# Altium schematic sheet Power.SchDoc: Power
size A; Author: Craig Hesling; DrawnBy: Craig Hesling; Revision: 1.1
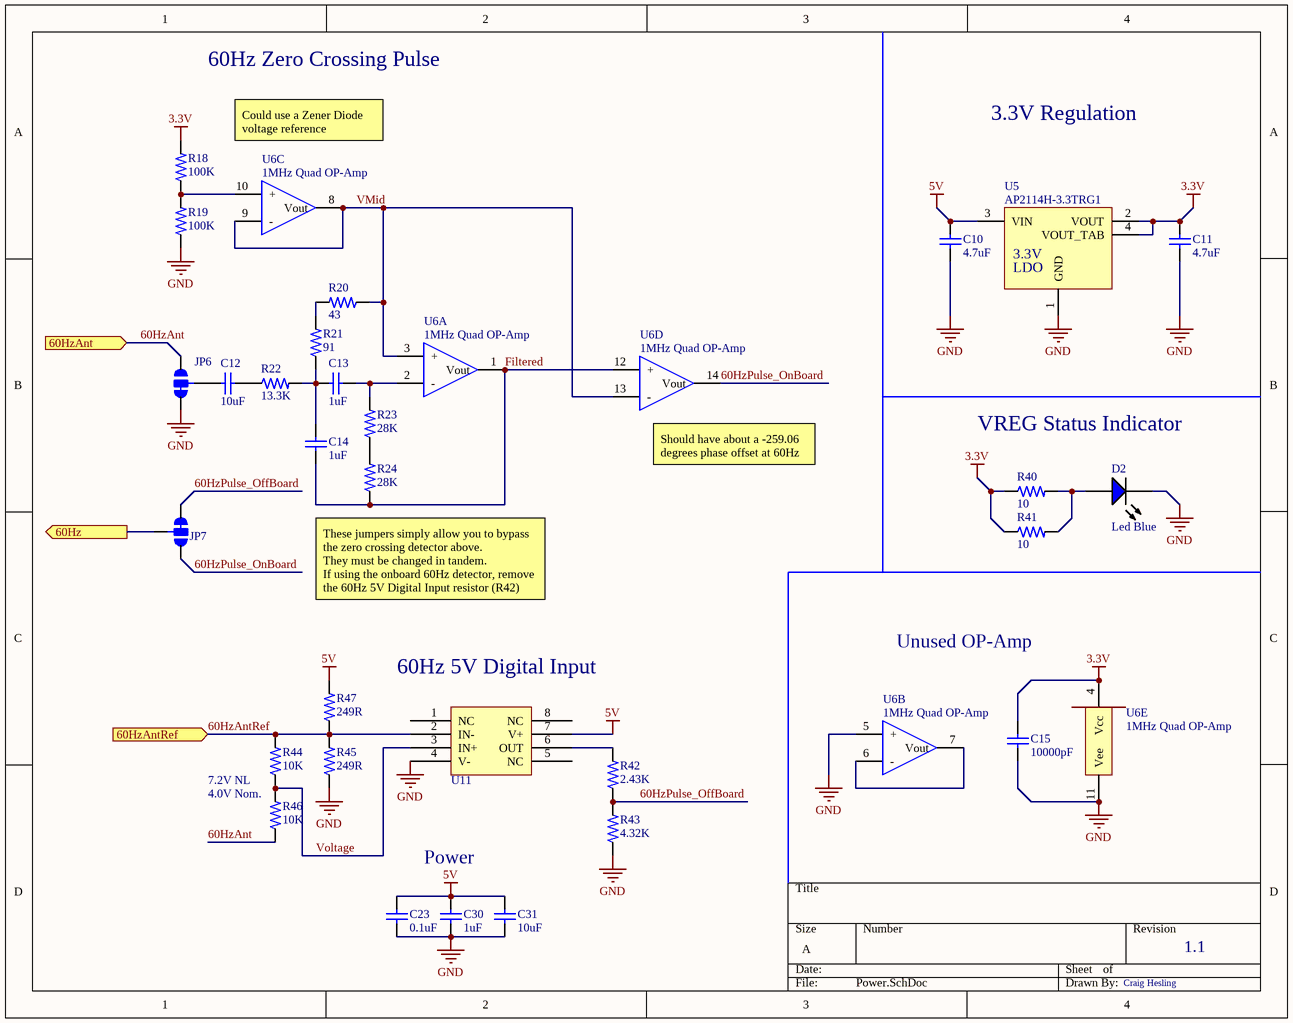
[diagram p0: Power.SchDoc]

## Parts
C10  4.7uF  [CAPC3216X18L - CAP1206 1.8MM TALL]
C11  4.7uF  [CAPC3216X18L - CAP1206 1.8MM TALL]
C12  10uF  [CAPC1608X09L - CAP0603]
C13  1uF  [CAPC1608X09L - CAP0603]
C14  1uF  [CAPC1608X09L - CAP0603]
C15  10000pF  [CAPC1608X09L - CAP0603]
C23  0.1uF  [CAPC1608X09L - CAP0603]
C30  1uF  [CAPC1608X09L - CAP0603]
C31  10uF  [CAPC1608X09L - CAP0603]
D2  Led Blue  [LED-0603-BLUE .7MM TALL]
JP6  JUMPER-PAD-3-2OF3_NC_BY_TRACE_SMALL  [PAD-JUMPER-3-2OF3_NC_BY_TRACE_YES_SILK_FULL_BOX]  (value not drawn)
JP7  JUMPER-PAD-3-2OF3_NC_BY_TRACE_SMALL  [PAD-JUMPER-3-2OF3_NC_BY_TRACE_YES_SILK_FULL_BOX]  (value not drawn)
R18  100K  [RESC1608X06L - RES0603]
R19  100K  [RESC1608X06L - RES0603]
R20  43  [RESC1608X06L - RES0603]
R21  91  [RESC1608X06L - RES0603]
R22  13.3K  [RESC1608X06L - RES0603]
R23  28K  [RESC1608X06L - RES0603]
R24  28K  [RESC1608X06L - RES0603]
R40  10  [RESC1608X06L - RES0603]
R41  10  [RESC1608X06L - RES0603]
R42  2.43K  [RESC1608X06L - RES0603]
R43  4.32K  [RESC1608X06L - RES0603]
R44  10K  [RESC1608X06L - RES0603]
R45  249R  [RESC1608X06L - RES0603]
R46  10K  [RESC1608X06L - RES0603]
R47  249R  [RESC1608X06L - RES0603]
U5  AP2114H-3.3TRG1  [SOT230P700X180-4L]
U6  1MHz Quad OP-Amp  [SOIC127P600X175-14L]  (parts A,B,C,D,E of 5)
U11  LT1818IS8#PBF  [SOIC127P600X175-8N]  (value not drawn)

## Ports
60Hz (out), 60HzAnt (in), 60HzAntRef (in)

## Nets
3.3V: C11.2 C15.2 R18.2 R40.1 R41.1 U5.2(VOUT) U5.4(VOUT_TAB) U6.4(Vcc)
5V: C10.2 C23.2 C30.2 C31.2 R47.2 U5.3(VIN) U11.7(V+)
GND: C10.1 C11.1 C15.1 C23.1 C30.1 C31.1 D2.K JP6.3 R19.1 R43.1 R45.1 U5.1(GND) U6.5(+) U6.11(Vee) U11.4(V-)
60Hz: JP7.2 ; port 60Hz
60HzAnt: JP6.1 R46.1 ; port 60HzAnt
60HzAntRef: R44.2 R45.2 R47.1 U11.2(IN-) ; port 60HzAntRef
60HzPulse_OffBoard: JP7.3 R42.1 R43.2
60HzPulse_OnBoard: JP7.1 U6.14(Vout)
Filtered: C14.1 R24.1 U6.1(Vout) U6.12(+)
VMid: R20.1 U6.3(+) U6.8(Vout) U6.9(-) U6.13(-)
Voltage: R44.1 R46.2 U11.3(IN+)
NetC12_1: C12.1 R22.1
NetC12_2: C12.2 JP6.2
NetC13_1: C13.1 R23.2 U6.2(-)
NetC13_2: C13.2 C14.2 R21.1 R22.2
NetD2_A: D2.A R40.2 R41.2
NetR18_1: R18.1 R19.2 U6.10(+)
NetR20_2: R20.2 R21.2
NetR23_1: R23.1 R24.2
NetR42_2: R42.2 U11.6(OUT)
NetU6_6: U6.6(-) U6.7(Vout)

Not connected (* = marked no-connect by the designer): U11 1(NC) 5(NC) 8(NC)

## Notes on the sheet
- 60Hz Zero Crossing Pulse
- Could use a Zener Diode voltage reference
- 3.3V Regulation
- VREG Status Indicator
- (near U6) Should have about a -259.06 degrees phase offset at 60Hz
- (near R24) These jumpers simply allow you to bypass the zero crossing detector above.
  They must be changed in tandem.
  If using the onboard 60Hz detector, remove the 60Hz 5V Digital Input resistor (R42) also.
- (near U11) 60Hz 5V Digital Input
- Unused OP-Amp
- 7.2V NL
- 4.0V Nom.
- (in symbol AP2114H-3.3TRG1) 3.3V; LDO

## Library data of the parts
C10 C11 = CAP1206 4.7uF 10% 25V X5R: SMT 1206 Ceramic Capacitor; TempCoeff: X5R; Tolerance: 10%; Voltage: 25V; Value: 4.7uF; Supplier 1: Digi-Key; Supplier Part Number 1: 587-1336-1-ND
C12 C31 = CAP0603 10uF 20% 6.3V X5R: SMT 0603 Ceramic Capacitor; TempCoeff: X5R; Tolerance: 20%; Voltage: 6.3V; Value: 10uF; Supplier 1: Digi-Key; Supplier 2: Digi-Key; Supplier Part Number 1: 587-1256-1-ND; Supplier Part Number 2: 490-3896-1-ND
C13 C14 C30 = CAP0603 1uF 10% 10V X7R: SMT 0603 Ceramic Capacitor; TempCoeff: X7R; Tolerance: 10%; Voltage: 10V; Value: 1uF; Supplier 1: Digi-Key; Supplier Part Number 1: 1276-1946-1-ND; Supplier 2: Digi-Key; Supplier Part Number 2: 399-3118-1-ND
C15 = CAP0603 10000pF 10% 50V X7R: SMT 0603 Ceramic Capacitor; TempCoeff: X7R; Tolerance: 10%; Voltage: 50V; Value: 10000pF; Supplier 1: Digi-Key; Supplier 2: Digi-Key; Supplier 3: Digi-Key; Supplier Part Number 1: 478-1215-1-ND; Supplier Part Number 2: 311-1080-1-ND; Supplier Part Number 3: 490-1494-1-ND
C23 = CAP0603 0.1uF 10% 25V X7R: SMT 0603 Ceramic Capacitor; TempCoeff: X7R; Tolerance: 10%; Voltage: 25V; Value: 0.1uF; Supplier 1: Digi-Key; Supplier 2: Digi-Key; Supplier Part Number 1: 311-1341-1-ND; Supplier Part Number 2: 490-1524-1-ND
D2 = LED0603 BLUE 20mA 250mcd: LED BLUE CLEAR 0603 SMD 145 mcd; Supplier 1: Digi-Key; Supplier Part Number 1: 732-4966-6-ND
R18 R19 = RES0603 100K 1% 1/10W: SMT 0603 Ceramic Resistor; Power: 1/10W; Tolerance: 1%; Value: 100K; Supplier 1: Digi-Key; Supplier Part Number 1: 311-100KHRCT-ND
R20 = RES0603 43 1% 1/10W: SMT 0603 Ceramic Resistor; Power: 1/10W; Tolerance: 1%; Value: 43; Supplier 1: Digi-Key; Supplier Part Number 1: 311-43.0HRCT-ND; Supplier 2: Digi-Key; Supplier Part Number 2: P43.0HCT-ND
R21 = RES0603 91 1% 1/10W: SMT 0603 Ceramic Resistor; Power: 1/10W; Tolerance: 1%; Value: 91; Supplier 1: Digi-Key; Supplier 2: Digi-Key; Supplier 3: Digi-Key; Supplier Part Number 1: 311-91.0HRCT-ND; Supplier Part Number 2: 541-91.0HCT-ND; Supplier Part Number 3: RHM91CFCT-ND
R22 = RES0603 13.3K 1% 1/10W: SMT 0603 Ceramic Resistor; Power: 1/10W; Tolerance: 1%; Value: 13.3K; Supplier 1: Digi-Key; Supplier 2: Digi-Key; Supplier Part Number 1: 311-13.3KHRCT-ND; Supplier Part Number 2: P13.3KHCT-ND
R23 R24 = RES0603 28K 0.1% 1/10W: SMT 0603 Ceramic Resistor; Power: 1/10W; Tolerance: 0.1%; Value: 28K; Supplier 1: Digi-Key; Supplier 2: Digi-Key; Supplier Part Number 1: YAG4680CT-ND; Supplier Part Number 2: P28KDBCT-ND
R40 R41 = RES0603 10 1% 1/10W: SMT 0603 Ceramic Resistor; Power: 1/10W; Tolerance: 1%; Value: 10; Supplier 1: Digi-Key; Supplier 2: Digi-Key; Supplier 3: Digi-Key; Supplier Part Number 1: 311-10.0HRCT-ND; Supplier Part Number 2: RMCF0603FT10R0CT-ND; Supplier Part Number 3: CR0603-FX-10R0ELFCT-ND
R42 = RES0603 2.43K 1% 1/10W: SMT 0603 Ceramic Resistor; Power: 1/10W; Tolerance: 1%; Value: 2.43K; Supplier 1: Digi-Key; Supplier 2: Mouser; Supplier Part Number 1: 311-2.43KHRDKR-ND; Supplier Part Number 2: 603-RC0603FR-072K43L
R43 = RES0603 4.32K 1% 1/10W: SMT 0603 Ceramic Resistor; Power: 1/10W; Tolerance: 1%; Value: 4.32K; Supplier 1: Digi-Key; Supplier 2: Digi-Key; Supplier 3: Digi-Key; Supplier Part Number 1: 311-4.32KHRTR-ND; Supplier Part Number 2: P4.32KHCT-ND; Supplier Part Number 3: CRCW06034K32FKEB-ND
R44 R46 = RES0603 10K 1% 1/10W: SMT 0603 Ceramic Resistor; Power: 1/10W; Tolerance: 1%; Supplier 1: Digi-Key; Supplier 2: Digi-Key; Supplier 3: Digi-Key; Supplier Part Number 1: 311-10.0KHRCT-ND; Supplier Part Number 2: RMCF0603FT10K0CT-ND; Supplier Part Number 3: P10.0KHCT-ND; Value: 10K
R45 R47 = RC0603FR-07249RL: RES SMD 249 OHM 1% 1/10W 0603; Manufacturer: Yageo; Power Rating: 100mW; Voltage Rating: 50V; Temperature Coefficient: 100ppm/°C; Supplier 1: Digi-Key; Manufacturer Part Number: RC0603FR-07249RL; Stock 1: 517619; Pricing 1: 1=0.1, 10=0.015, 100=0.006, 1000=0.00268, 2500=0.00233 (USD); Case/Package: 0603; Case Code (Imperial): 0603; Case Code (Metric): 1608; Min Operating Temperature: -55°C; Max Operating Temperature: 155°C; Resistance: 249R; Tolerance: 1%; Packaging: Tape and Reel; Package Quantity: 1; Termination: SMD/SMT; Composition: Thick Film; Number of Terminations: 2; Max Power Dissipation: 100mW; Voltage Rating (DC): 50V; Military Standard: Not; Length: 0.063inch; Height: 0.022inch; Width: 0.031inch; Depth: 0.8mm; Lead Free: Lead Free; ComponentLink1URL: https://datasheet.ciiva.com/2454/pyu-r-int-thick-7-2454858.pdf; ComponentLink1Description: https://datasheet.ciiva.com/2454/pyu-r-int-thick-7-2454858.pdf; ComponentLink2URL: https://datasheet.ciiva.com/2454/pyu-r-int-thick-7-2454859.pdf; ComponentLink2Description: https://datasheet.ciiva.com/2454/pyu-r-int-thick-7-2454859.pdf; ComponentLink3URL: https://datasheet.ciiva.com/2454/pyu-r-int-thick-7-2454860.pdf; ComponentLink3Description: https://datasheet.ciiva.com/2454/pyu-r-int-thick-7-2454860.pdf; Supplier Part Number 1: 311-249HRDKR-ND
U5 = AP2114H-3.3TRG1: AP2114 3.3V Fixed LDO Regulator; Supplier 1: Digi-Key; Supplier Part Number 1: AP2114H-3.3TRG1DICT-ND
U6 = LM324DR2G: ON Semi LM324DR2G 1MHz Quad OP-Amp; Supplier 1: Digi-Key; Supplier Part Number 1: LM324DR2GOSCT-ND
U11 = LT1818IS8#PBF: IC OPAMP VFB 400MHZ 8SO; Manufacturer: Linear Technology; Unity Gain Bandwidth Product: 360MHz; Common Mode Rejection Ratio: 73dB; Min Dual Supply Voltage: 1.75V; Max Dual Supply Voltage: 6.3V; Slew Rate: 2500V/µs; Max Supply Voltage: 12.6V; Min Supply Voltage: 3.5V; Number of Circuits: 1; Input Bias Current: 2uA; Input Offset Voltage (Vos): 1.5mV; Operating Supply Current: 9mA; Output Current per Channel: 70mA; Voltage Gain: 72.04dB; Power Supply Rejection Ratio (PSRR): 78dB; Supplier 1: Digi-Key; Manufacturer Part Number: LT1818IS8#PBF; Stock 1: 576; Pricing 1: 1=2.36, 25=1.6728, 100=1.377 (USD); Case/Package: SOIC; Number of Pins: 8; Min Operating Temperature: -40°C; Max Operating Temperature: 85°C; Package Quantity: 100; Packaging: Rail/Tube; Nominal Gain Bandwidth Product: 400MHz; Gain Bandwidth Product: 400MHz; Number of Elements: 1; Number of Channels: 1; Lead Free: Lead Free; ComponentLink1URL: https://datasheet.ciiva.com/1805/1191-1805828.pdf; ComponentLink1Description: https://datasheet.ciiva.com/1805/1191-1805828.pdf; Supplier Part Number 1: LT1818IS8#PBF-ND